# Altium schematic sheet FPGA_programmer.SchDoc
size B; DocumentNumber: 4; SheetNumber: 4; SheetTotal: 4
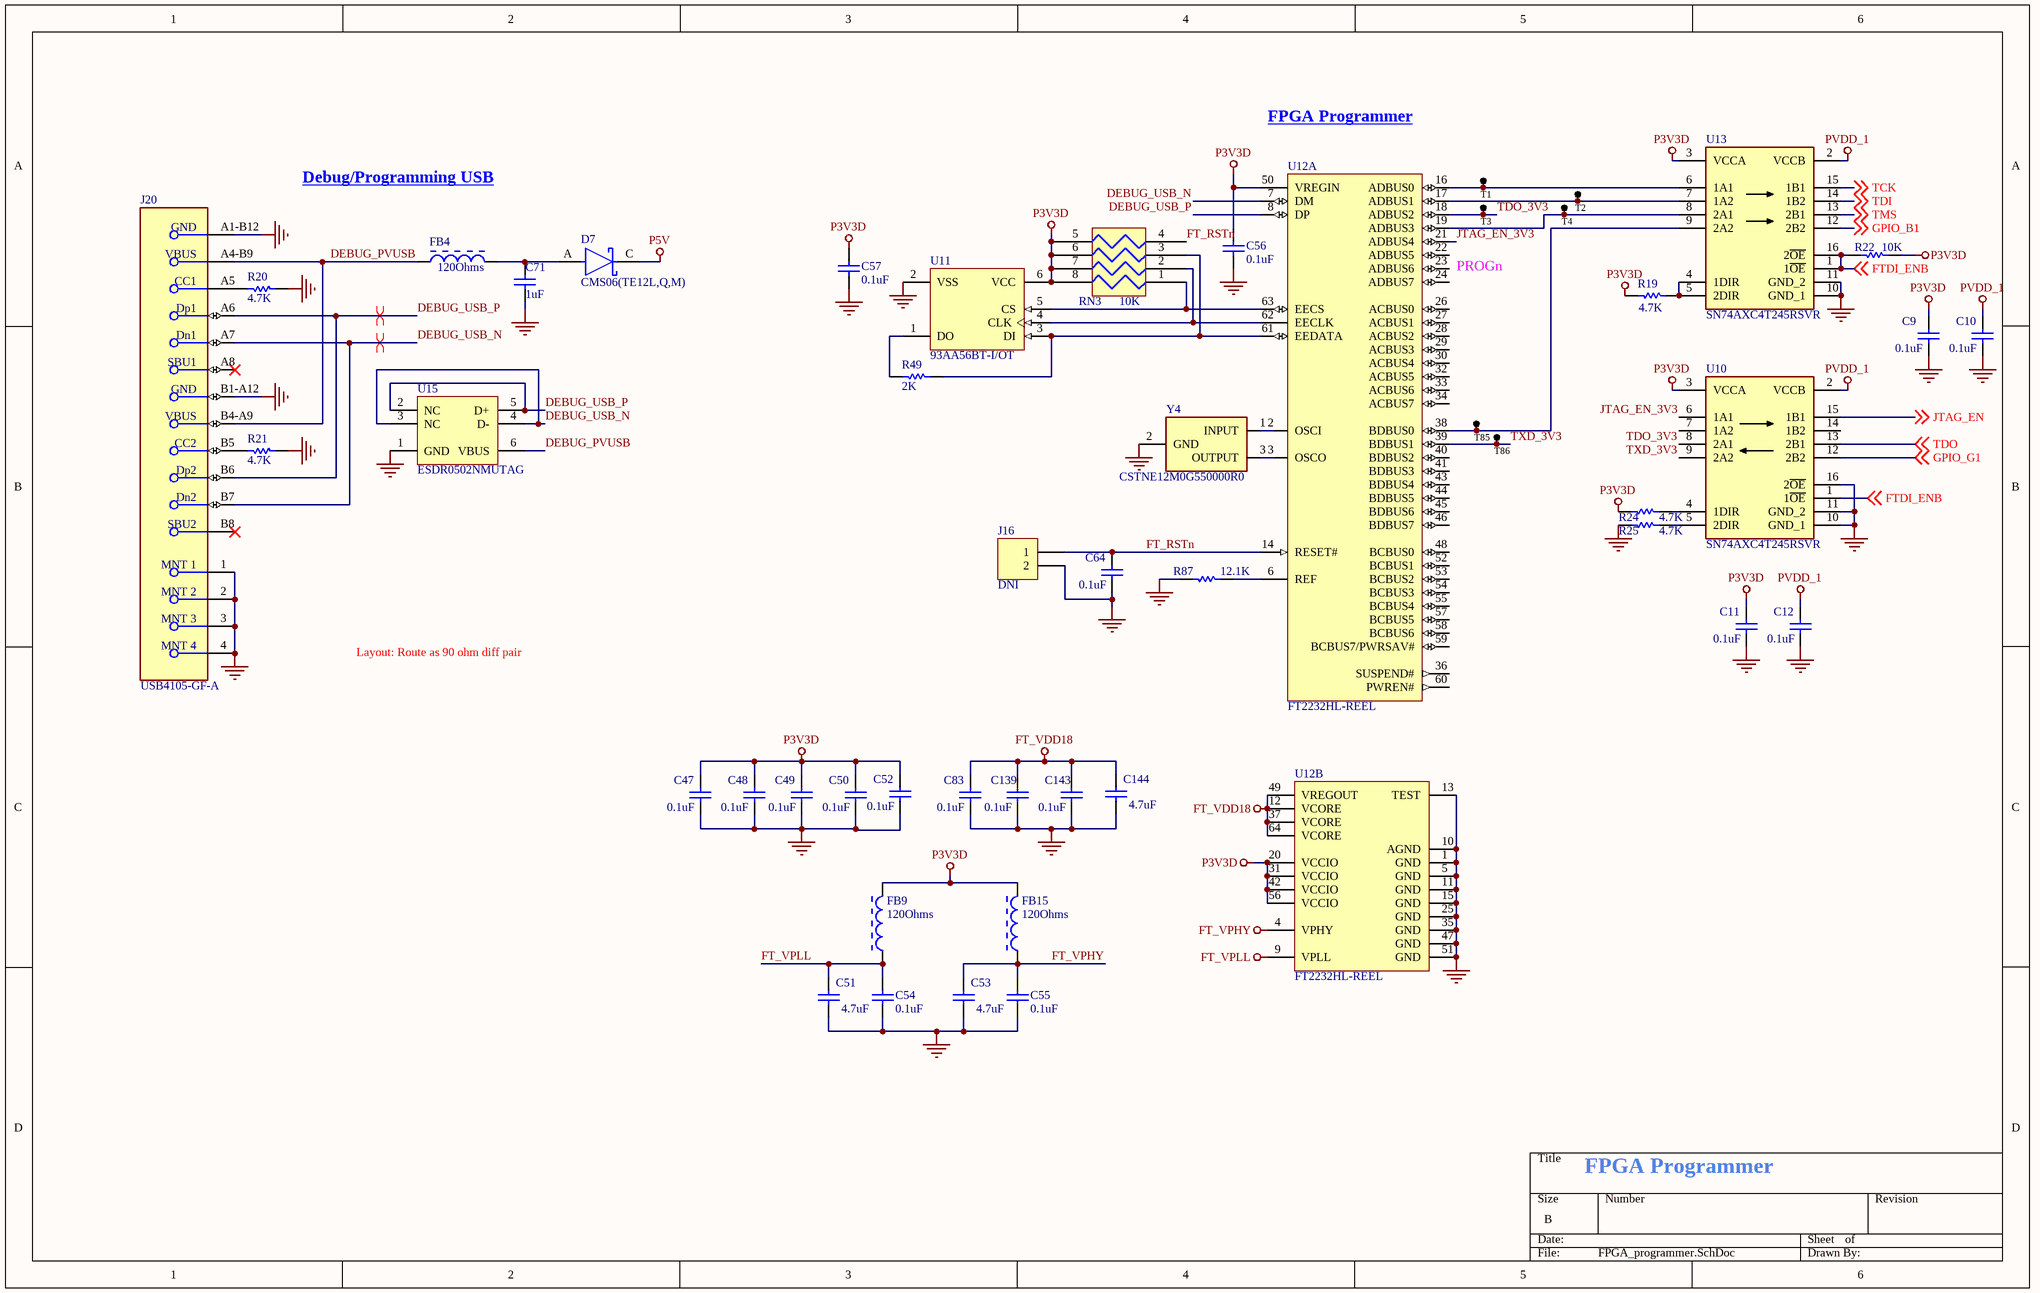
[diagram p0: FPGA_programmer.SchDoc]

## Parts
C9  0.1uF  [CAPC1005X55USR]
C10  0.1uF  [CAPC1005X55USR]
C11  0.1uF  [CAPC1005X55USR]
C12  0.1uF  [CAPC1005X55USR]
C47  0.1uF  [CAPC1005X55USR]
C48  0.1uF  [CAPC1005X55USR]
C49  0.1uF  [CAPC1005X55USR]
C50  0.1uF  [CAPC1005X55USR]
C51  4.7uF  [CAPC1005X55USR]
C52  0.1uF  [CAPC1005X55USR]
C53  4.7uF  [CAPC1005X55USR]
C54  0.1uF  [CAPC1005X55USR]
C55  0.1uF  [CAPC1005X55USR]
C56  0.1uF  [CAPC1005X55USR]
C57  0.1uF  [CAPC1005X55USR]
C64  0.1uF  [CAPC1005X55USR]
C71  1uF  [CAPC1005X55USR]
C83  0.1uF  [CAPC1005X55USR]
C139  0.1uF  [CAPC1005X55USR]
C143  0.1uF  [CAPC1005X55USR]
C144  4.7uF  [CAPC1005X55USR]
D7  CMS06(TE12L,Q,M)  [SOD-128]
FB4  120Ohms  [0402_FB]
FB9  120Ohms  [0402_FB]
FB15  120Ohms  [0402_FB]
J16  Content: DNI  [HDR2X1_MALE_2.54MM]  (hidden comment: Header 2X1_2.54MM)
J20  USB4105-GF-A  [USB4105_GCT]
R19  4.7K  [RESC1005X40USR]
R20  4.7K  [RESC1005X40USR]
R21  4.7K  [RESC1005X40USR]
R22  10K  [RESC1005X40USR]
R24  4.7K  [RESC1005X40USR]
R25  4.7K  [RESC1005X40USR]
R49  2K  [RESC1005X40USR]
R87  12.1K  [RESC1005X40USR]
RN3  10K  [RESCAXS50P100X200X45-8NA]
T1  TP_S  [TP 1mm]  (value not drawn)  (no BOM)
T2  TP_S  [TP 1mm]  (value not drawn)  (no BOM)
T3  TP_S  [TP 1mm]  (value not drawn)  (no BOM)
T4  TP_S  [TP 1mm]  (value not drawn)  (no BOM)
T85  TP_S  [TP 1mm]  (value not drawn)  (no BOM)
T86  TP_S  [TP 1mm]  (value not drawn)  (no BOM)
U10  SN74AXC4T245RSVR  [QFN40P260X180X55-16N]
U11  93AA56BT-I/OT  [SOT23-6]
U12  FT2232HL-REEL  [QFP50P1200X1200X160-64N]  (parts A,B of 2)
U13  SN74AXC4T245RSVR  [QFN40P260X180X55-16N]
U15  ESDR0502NMUTAG  [ONSC-UDFN-6-517AA-01_V]
Y4  CSTNE12M0G550000R0  [OSC_CSTNE12M0G550000R0]

## Nets
FT_VDD18: C83.2 C139.2 C143.2 C144.2 U12.12(VCORE) U12.37(VCORE) U12.49(VREGOUT) U12.64(VCORE)
FT_VPHY: C53.2 C55.2 FB15.1 U12.4(VPHY)
FT_VPLL: C51.2 C54.2 FB9.1 U12.9(VPLL)
GND: C9.1 C10.1 C11.1 C12.1 C47.1 C48.1 C49.1 C50.1 C51.1 C52.1 C53.1 C54.1 C55.1 C56.1 C57.1 C64.1 C71.1 C83.1 C139.1 C143.1 C144.1 J16.2 J20.1(MNT_1) J20.2(MNT_2) J20.3(MNT_3) J20.4(MNT_4) J20.A1-B12(GND) J20.B1-A12(GND) R20.1 R21.1 R25.2 R87.1 U10.10(GND_1) U10.11(GND_2) U10.16(2~{OE}) U11.2(VSS) U12.1(GND) U12.5(GND) U12.10(AGND) U12.11(GND) U12.13(TEST) U12.15(GND) U12.25(GND) U12.35(GND) U12.47(GND) U12.51(GND) U13.10(GND_1) U13.11(GND_2) U15.1(GND) Y4.2(GND)
P3V3D: C9.2 C11.2 C47.2 C48.2 C49.2 C50.2 C52.2 C56.2 C57.2 FB9.2 FB15.2 R19.2 R22.2 R24.2 RN3.5 RN3.6 RN3.7 RN3.8 U10.3(VCCA) U11.6(VCC) U12.20(VCCIO) U12.31(VCCIO) U12.42(VCCIO) U12.50(VREGIN) U12.56(VCCIO) U13.3(VCCA)
P5V: D7.C
PVDD_1: C10.2 C12.2 U10.2(VCCB) U13.2(VCCB)
DEBUG_PVUSB: FB4.1 J20.A4-B9(VBUS) J20.B4-A9(VBUS) U15.6(VBUS)
DEBUG_USB_N: J20.A7(Dn1) J20.B7(Dn2) U12.7(DM) U15.3(NC) U15.4(D-)
DEBUG_USB_P: J20.A6(Dp1) J20.B6(Dp2) U12.8(DP) U15.2(NC) U15.5(D+)
FT_RSTn: C64.2 J16.1 RN3.4 U12.14(RESET#)
FTDI_ENB: R22.1 U10.1(1~{OE}) U13.1(1~{OE}) U13.16(2~{OE}) ; off-sheet FTDI_ENB
GPIO_B1: U13.12(2B2) ; off-sheet GPIO_B1
GPIO_G1: U10.12(2B2) ; off-sheet GPIO_G1
JTAG_EN: U10.15(1B1) ; off-sheet JTAG_EN
JTAG_EN_3V3: U10.6(1A1) U12.21(ADBUS4)
TCK: U13.15(1B1) ; off-sheet TCK
TDI: U13.14(1B2) ; off-sheet TDI
TDO: U10.13(2B1) ; off-sheet TDO
TDO_3V3: T3.1 U10.8(2A1) U12.18(ADBUS2)
TMS: U13.13(2B1) ; off-sheet TMS
TXD_3V3: T86.1 U10.9(2A2) U12.39(BDBUS1)
NetC71_2: C71.2 D7.A FB4.2
NetJ20_A5: J20.A5(CC1) R20.2
NetJ20_B5: J20.B5(CC2) R21.2
NetR19_1: R19.1 U13.4(1DIR) U13.5(2DIR)
NetR24_1: R24.1 U10.4(1DIR)
NetR25_1: R25.1 U10.5(2DIR)
NetR49_1: R49.1 RN3.3 U11.3(DI) U12.61(EEDATA)
NetR49_2: R49.2 U11.1(DO)
NetR87_2: R87.2 U12.6(REF)
NetRN3_1: RN3.1 U11.5(CS) U12.63(EECS)
NetRN3_2: RN3.2 U11.4(CLK) U12.62(EECLK)
NetT1_1: T1.1 U12.16(ADBUS0) U13.6(1A1)
NetT2_1: T2.1 U12.17(ADBUS1) U13.7(1A2)
NetT4_1: T4.1 U12.19(ADBUS3) U13.8(2A1)
NetT85_1: T85.1 U12.38(BDBUS0) U13.9(2A2)
NetU12_2: U12.2(OSCI) Y4.1(INPUT)
NetU12_3: U12.3(OSCO) Y4.3(OUTPUT)

Not connected (* = marked no-connect by the designer): J20 A8(SBU1)* B8(SBU2)*; U10 7(1A2) 14(1B2); U12 22(ADBUS5) 23(ADBUS6) 24(ADBUS7) 26(ACBUS0) 27(ACBUS1) 28(ACBUS2) 29(ACBUS3) 30(ACBUS4) 32(ACBUS5) 33(ACBUS6) 34(ACBUS7) 36(SUSPEND#) 40(BDBUS2) 41(BDBUS3) 43(BDBUS4) 44(BDBUS5) 45(BDBUS6) 46(BDBUS7) 48(BCBUS0) 52(BCBUS1) 53(BCBUS2) 54(BCBUS3) 55(BCBUS4) 57(BCBUS5) 58(BCBUS6) 59(BCBUS7/PWRSAV#) 60(PWREN#)

## Layout directives
differential pair: DEBUG_USB_N, DEBUG_USB_P

## Notes on the sheet
- FPGA Programmer
- Debug/Programming USB
- PROGn
- Layout: Route as 90 ohm diff pair

## Library data of the parts
C9-C12 C47-C50 C52 C54-C57 C64 C83 C139 C143 = CAP CER 0.1UF 16V X7R 0402: Manufacturer Part Number: CGA2B1X7R1C104K050BC; Manufacturer: TDK Corporation; Supplier Part Number 1: 445-5613-2-ND; Package: 0402; Height: 0.55mm; Supplier 1: Digi-Key; value: 0.1uF
C51 C53 C144 = CAP CER 4.7UF 10V X5R 0402: Manufacturer Part Number: C1005X5R1A475M050BC; Manufacturer: TDK Corporation; Package: 0402; Supplier Part Number 1: 445-8023-1-ND; value: 4.7uF; Supplier 1: Digi-Key; Height: 0.55mm; ComponentLink1Description: New link; ComponentLink1URL: *
C71 = CAP CER 1UF 25V X5R 0402: Manufacturer Part Number: GRM155R61E105MA12D; Manufacturer: Murata Electronics; Part #: E-CAP-042; value: 1uF; Supplier Part Number 1: 490-10018-1-ND; Package: 0402; Supplier 1: Digi-Key; Height: 0.55mm; ComponentLink1Description: New link; ComponentLink1URL: *
D7 = D_CMS06(TE12L,Q,M): Rectifier Diode Schottky 30V 2A 2-Pin M-FLAT T/R; Manufacturer: Toshiba; Forward Voltage: 370mV; Peak Non-Repetitive Surge Current: 40A; Max Reverse Leakage Current: 3mA; Element Configuration: Single; Package Quantity: 1; Max Operating Temperature: 125°C; Mount: Surface Mount; Max Repetitive Reverse Voltage (Vrrm): 30V; Forward Current: 2A; Number of Pins: 2; Min Operating Temperature: -40°C; Radiation Hardening: No; Average Rectified Current: 2A; Contact Plating: Tin,Silver; Max Reverse Voltage (DC): 30V; Max Surge Current: 40A; Packaging: Tape and Reel; Supplier 1: Digi-Key; Manufacturer Part Number: CMS06(TE12L,Q,M); RoHS: No; Category: Rectifier Diodes; Stock 1: 49976; Pricing 1: 1=0.56000, 10=0.48200, 100=0.35950, 500=0.28248, 1000=0.21828 (USD); Max Reverse Current: 3mA; Series: -; RoHS Compliant: No; ComponentLink1URL: https://datasheet.ciiva.com/916/dst-cms06-tde-en-1613-916722.pdf?src-supplier=Digi-Key; ComponentLink1Description: https://datasheet.ciiva.com/916/dst-cms06-tde-en-1613-916722.pdf?src-supplier=Digi-Key; ComponentLink2URL: https://datasheet.ciiva.com/916/dst-cms06-tde-en-1613-916723.pdf?src-supplier=Digi-Key; ComponentLink2Description: https://datasheet.ciiva.com/916/dst-cms06-tde-en-1613-916723.pdf?src-supplier=Digi-Key; ComponentLink3URL: https://datasheet.ciiva.com/8281/cms06-datasheet-en-20131101-8281819.pdf?src-supplier=Avnet; ComponentLink3Description: https://datasheet.ciiva.com/8281/cms06-datasheet-en-20131101-8281819.pdf?src-supplier=Avnet; Supplier Part Number 1: CMS06QMCT-ND
FB4 FB9 FB15 = FERRITE BEAD 120 OHM 0402 1LN: Manufacturer Part Number: BLM15AG121SN1D; Manufacturer: Murata Electronics; Supplier Part Number 1: 490-1005-2-ND; Package: 0402; Value: 120Ohms; Supplier 1: Digi-Key; Height: 0.55mm; ComponentLink1Description: New link; ComponentLink1URL: *
J16 = Header 2X1_2.54MM: Conn Header Vert 2POS 2.54MM; Manufacturer Part Number: PRPC002SAAN-RC; Manufacturer: Sullins; Number of Positions: 2; Pitch: 0.1inch; Supplier Part Number 1: S1011EC-02-ND; Supplier 1: Digi-Key; RoHS: Yes; Category: Connectors; Stock: 31528; Pricing: 1=0.08000, 10=0.07300, 25=0.05400, 50=0.04640, 100=0.04490, 250=0.03872, 500=0.03716 (USD); Mounting Technology: Through Hole; Color: Black; Contact Plating: Gold; Package Quantity: 1; Number of Rows: 1; Packaging: Bulk; Termination: Solder; Series: -; Contact Type: Male Pin; Contact Mating Length: 0.23inch; RoHS Compliant: Yes; ComponentLink1URL: https://datasheet.ciiva.com/741/xrxczzzsxxn-rc-st-11635-b-741243.pdf?src-supplier=Digi-Key; ComponentLink1Description: https://datasheet.ciiva.com/741/xrxczzzsxxn-rc-st-11635-b-741243.pdf?src-supplier=Digi-Key
J20 = CONN RCP USB2.0 TYP C 24P SMD RA: Conn USB 2.0 Type C RCP 24 POS 0.3mm/0.5mm Solder RA SMD 24 Terminal 1 Port T/R; Manufacturer: Global Connector Technology; Category: USB Connectors; RoHS: No; Manufacturer Part Number: USB4105-GF-A; Supplier 1: Newark; Stock 1: 2162; Pricing 1: 1=0.75400, 10=0.68200, 25=0.64000, 50=0.61200, 100=0.58400, 250=0.52900, 500=0.48700 (USD); Supplier Part Number 1: 86AH2021
R19-R21 R24 R25 = RES 4.7K OHM 1% 1/16W 0402: RES SMD 4.7K OHM 1% 1/16W 0402; Manufacturer: Stackpole Electronics Inc; Manufacturer Part Number: RMCF0402FT4K70; Supplier Part Number 1: RMCF0402FT4K70TR-ND; Supplier 1: Digi-Key; Height: 0.4mm; Package: 0402; value: 4.7K
R22 = RES SMD 10K OHM 1% 1/16W 0402: Manufacturer: Samsung Electro-Mechanics; Manufacturer Part Number: RC1005F103CS; Supplier Part Number 1: 1276-3431-2-ND; Package: 0402; Height: 0.4mm; Supplier 1: Digi-Key; value: 10K
R49 = RES 2K OHM 1% 1/16W 0402: Manufacturer: YAGEO; Manufacturer Part Number: RC0402FR-072KL; Supplier Part Number 1: 311-2KLRCT-ND; Package: 0402; Height: 0.4mm; Supplier 1: Digi-Key; value: 2K
R87 = RES 12.1K OHM 1% 1/16W 0402: Manufacturer: Yageo; Manufacturer Part Number: RC0402FR-0712K1L; Package: 0402; Supplier Part Number 1: 311-12.1KLRTR-ND; Height: 0.4mm; Supplier 1: Digi-Key; value: 12.1K
RN3 = RES ARRAY 4 RES 47K OHM 0804: Res Thick Film Array 10K Ohm 5% ±200ppm/°C ISOL 8-Pin 0804(4 X 0402) Convex SMD Automotive T/R; Manufacturer: Panasonic; Manufacturer Part Number: EXB-28V103JX; Number of Resistors: 4; Power Dissipation: 63mW; Voltage Rating: 50V; Circuit Type: Isolated; Power Per Element: 62.5mW; Number of Contacts: 8; Voltage Rating (DC): 100V; Supplier 1: Digi-Key; Supplier Part Number 1: Y7103CT-ND; RoHS: Yes; Category: Resistor Arrays; Stock: 1570078; Pricing: 1=0.10000, 10=0.08100, 25=0.05640, 50=0.04380, 100=0.03130, 250=0.02444, 500=0.01942, 1000=0.01378, 5000=0.01065 (USD); Mounting Technology: Surface Mount; Case/Package: 0804; Pins: 8; Case Code (Metric): 1005; Case Code (Imperial): 0402; Min Operating Temperature: -55°C; Max Operating Temperature: 125°C; Value: 10K; Packaging: Tape and Reel; Package Quantity: 1; Temperature Coefficient: 200ppm/°C; Series: EXB; Tolerance: 5%; Number of Elements: 4; Termination: Convex; Resistance Tolerance: 5%; Technology: THICK FILM; Length: 2mm; Width: 1mm; Height: 0.35mm; Depth: 1mm; Terminal Pitch: 0.5mm; Radiation Hardening: No; Lead Free: Lead Free; RoHS Compliant: Yes; Military Standard: Not; Reach SVHC Compliant: Unknown; ComponentLink1URL: https://datasheet.ciiva.com/46387/1480003-46387949.pdf?src-supplier=Element14; ComponentLink1Description: https://datasheet.ciiva.com/46387/1480003-46387949.pdf?src-supplier=Element14; ComponentLink2URL: https://datasheet.ciiva.com/46376/1480003-46376265.pdf?src-supplier=Element14; ComponentLink2Description: https://datasheet.ciiva.com/46376/1480003-46376265.pdf?src-supplier=Element14; ComponentLink3URL: https://datasheet.ciiva.com/28418/1790599-28418558.pdf?src-supplier=Element14; ComponentLink3Description: https://datasheet.ciiva.com/28418/1790599-28418558.pdf?src-supplier=Element14; ComponentLink4URL: https://datasheet.ciiva.com/28636/1790599-28636885.pdf?src-supplier=Element14; ComponentLink4Description: https://datasheet.ciiva.com/28636/1790599-28636885.pdf?src-supplier=Element14; ComponentLink5URL: https://datasheet.ciiva.com/30209/aoc0000ce1-30209125.pdf?src-supplier=Onlinecomponents.com; ComponentLink5Description: https://datasheet.ciiva.com/30209/aoc0000ce1-30209125.pdf?src-supplier=Onlinecomponents.com
T1-T4 T85 T86 = TP_S: test point
U10 U13 = SN74AXC4T245RSVR: 4-Bit Bus Transceiver with Configurable Voltage Translation and Tri-State Outputs 16-Pin UQFN; Manufacturer: Texas Instruments; Supplier 1: Digi-Key; Supplier Part Number 1: 296-53432-1-ND; Manufacturer Part Number: SN74AXC4T245RSVR; RoHS: Yes; Category: Buffers, Drivers and Transceivers; Stock: 6479; Pricing: 1=1.48000, 10=1.32500, 25=1.25760, 100=1.03290, 250=0.96552, 500=0.85326, 1000=0.67362 (USD); ComponentLink1URL: http://www.ti.com/general/docs/suppproductinfo.tsp?distId=10&amp;gotoUrl=http%3A%2F%2Fwww.ti.com%2Flit%2Fgpn%2Fsn74axc4t245&src-supplier=Digi-Key; ComponentLink1Description: http://www.ti.com/general/docs/suppproductinfo.tsp?distId=10&amp;gotoUrl=http%3A%2F%2Fwww.ti.com%2Flit%2Fgpn%2Fsn74axc4t245&src-supplier=Digi-Key
U11 = 93AA56BT-I/OT: IC EEPROM 2KBIT SPI 2MHZ SOT23-6; Manufacturer: Microchip Technology; Supplier Part Number 1: 93AA56BT-I/OTTR-ND; Manufacturer Part Number: 93AA56BT-I/OT; Supplier 1: Digi-Key
U12 = FT2232HL-REEL: IC USB HS DUAL UART/FIFO 64-LQFP; Manufacturer: FTDI; Number of Channels per Chip: 2; Standard Supported: RS232,RS422,RS485; Maximum Data Rate: 480Mbit/s; Package Reference: LQFP-64; Manufacturer URL: http://www.nxp.com/; Length: 10mm; Width: 10mm; Minimum Operating Temperature: -40°C; Dimensions: 10x10x1.4mm; Package Type: LQFP; Mounting Type: SurfaceMount; Datasheet URL: http://www.ftdichip.com/Support/Documents/DataSheets/ICs/DS_FT2232H.pdf; Datasheet Version: Rev. 2.5, 07/2016; Height: 1.4mm; Supplier Part Number 1: 6877720P; Manufacturer Part Number: FT2232HL-REEL; Supplier 1: RS Components
U15 = ONSC-ESDR0502N-UDFN-6-517AA-01: TVS DIODE 5.5VWM 6UDFN; Manufacturer: ON Semiconductor; ComponentLink2URL: http://www.onsemi.cn/pub_link/Collateral/ESDR0502N-D.PDF; ComponentLink3URL: http://www.onsemi.com/pub_link/Collateral/517AA.PDF; ComponentLink1Description: Manufacturer URL; ComponentLink2Description: Datasheet; ComponentLink3Description: Package Specification; ComponentLink1URL: http://www.onsemi.com/; Supplier Part Number 1: 863-ESDR0502NMUTAG; Manufacturer Part Number: ESDR0502NMUTAG; Supplier 1: Mouser
Y4 = CSTNE12M0G550000R0: CERAMIC RES 12.0000MHZ 33PF SMD; Manufacturer: Murata Electronics; Datasheet Link: https://www.murata.com/en-eu/products/productdata/8801162067998/SPEC-CSTNE12M0G550000R0.pdf?1559743212000; Height: 0.8mm; Manufacturer Part Number: CSTNE12M0G550000R0; Supplier Part Number 1: 81-CSTNE12M0G550000R; Supplier 1: Mouser